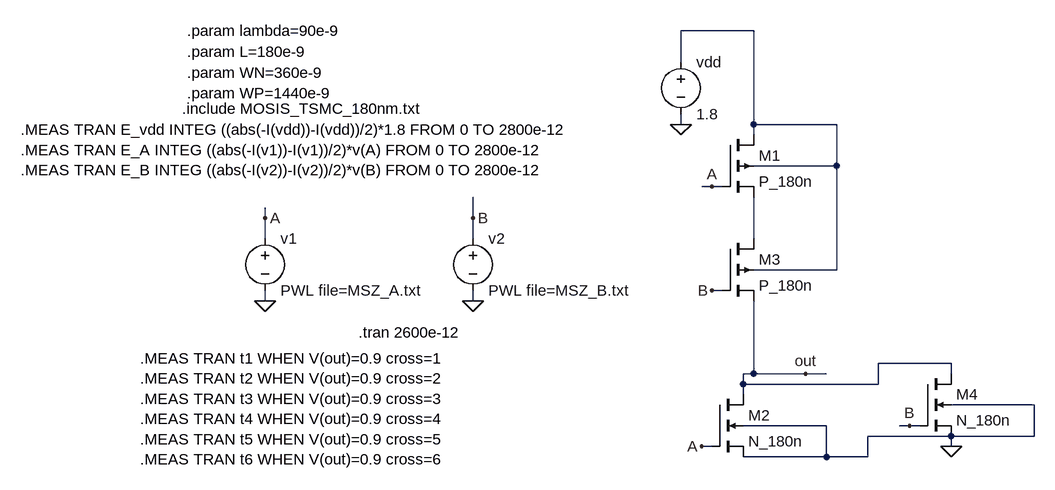
[diagram p0: schematic nor.asc]
nor.asc, the LTspice schematic file:
Version 4
SHEET 1 1028 680
WIRE 576 -128 464 -128
WIRE 464 -80 464 -128
WIRE 464 16 464 0
WIRE 576 16 576 -128
WIRE 704 16 576 16
WIRE 576 32 576 16
WIRE 704 80 704 16
WIRE 704 80 576 80
WIRE 512 112 496 112
WIRE 528 112 512 112
WIRE -176 160 -176 144
WIRE 144 160 144 128
WIRE -176 192 -176 160
WIRE 144 192 144 160
WIRE 576 192 576 128
WIRE 704 240 704 80
WIRE 704 240 576 240
WIRE 528 272 512 272
WIRE -176 288 -176 272
WIRE 144 288 144 272
WIRE 880 384 768 384
WIRE 576 400 576 288
WIRE 576 400 560 400
WIRE 656 400 576 400
WIRE 688 400 656 400
WIRE 880 400 880 384
WIRE 560 416 560 400
WIRE 768 416 768 384
WIRE 768 416 560 416
WIRE 560 432 560 416
WIRE 1008 448 880 448
WIRE 688 480 560 480
WIRE 816 480 800 480
WIRE 832 480 816 480
WIRE 880 496 752 496
WIRE 1008 496 1008 448
WIRE 1008 496 880 496
WIRE 512 512 496 512
WIRE 880 512 880 496
WIRE 688 528 688 480
WIRE 688 528 560 528
WIRE 752 528 752 496
WIRE 752 528 688 528
FLAG 880 512 0
FLAG 464 16 0
FLAG -176 288 0
FLAG 144 288 0
FLAG -176 160 A
FLAG 512 112 A
FLAG 496 512 A
FLAG 144 160 B
FLAG 512 272 B
FLAG 816 480 B
FLAG 656 400 out
SYMBOL pmos4 528 32 R0
SYMATTR InstName M1
SYMATTR Value P_180n
SYMATTR Value2 l={L} w={WP} ad={WP*5*lambda} as={WP*5*lambda} pd={2*WP+10*lambda} ps={2*WP+10*lambda}
SYMBOL nmos4 512 432 R0
SYMATTR InstName M2
SYMATTR Value N_180n
SYMATTR Value2 l={L} w={WN} ad={WN*5*lambda} as={WN*5*lambda} pd={2*WN+10*lambda} ps={2*WN+10*lambda}
SYMBOL voltage 464 -96 R0
SYMATTR InstName vdd
SYMATTR Value 1.8
SYMBOL pmos4 528 192 R0
SYMATTR InstName M3
SYMATTR Value P_180n
SYMATTR Value2 l={L} w={WP} ad={WP*5*lambda} as={WP*5*lambda} pd={2*WP+10*lambda} ps={2*WP+10*lambda}
SYMBOL nmos4 832 400 R0
SYMATTR InstName M4
SYMATTR Value N_180n
SYMATTR Value2 l={L} w={WN} ad={WN*5*lambda} as={WN*5*lambda} pd={2*WN+10*lambda} ps={2*WN+10*lambda}
SYMBOL voltage -176 176 R0
WINDOW 123 0 0 Left 0
WINDOW 39 0 0 Left 0
SYMATTR InstName v1
SYMATTR Value PWL file=MSZ_A.txt
SYMBOL voltage 144 176 R0
WINDOW 123 0 0 Left 0
WINDOW 39 0 0 Left 0
SYMATTR InstName v2
SYMATTR Value PWL file=MSZ_B.txt
TEXT -296 -128 Left 2 !.param lambda=90e-9
TEXT -296 -96 Left 2 !.param L=180e-9
TEXT -296 -64 Left 2 !.param WN=360e-9
TEXT -296 -32 Left 2 !.param WP=1440e-9
TEXT -32 336 Left 2 !.tran 2600e-12
TEXT -304 -8 Left 2 !.include MOSIS_TSMC_180nm.txt
TEXT -368 376 Left 2 !.MEAS TRAN t1 WHEN V(out)=0.9 cross=1\n.MEAS TRAN t2 WHEN V(out)=0.9 cross=2\n.MEAS TRAN t3 WHEN V(out)=0.9 cross=3\n.MEAS TRAN t4 WHEN V(out)=0.9 cross=4\n.MEAS TRAN t5 WHEN V(out)=0.9 cross=5\n.MEAS TRAN t6 WHEN V(out)=0.9 cross=6
TEXT -552 24 Left 2 !.MEAS TRAN E_vdd INTEG ((abs(-I(vdd))-I(vdd))/2)*1.8 FROM 0 TO 2800e-12\n.MEAS TRAN E_A INTEG ((abs(-I(v1))-I(v1))/2)*v(A) FROM 0 TO 2800e-12\n.MEAS TRAN E_B INTEG ((abs(-I(v2))-I(v2))/2)*v(B) FROM 0 TO 2800e-12

The netlist it stands for:
* nor.asc
M1 N001 A N002 N001 P_180n l={L} w={WP} ad={WP*5*lambda} as={WP*5*lambda} pd={2*WP+10*lambda} ps={2*WP+10*lambda}
M2 out A 0 0 N_180n l={L} w={WN} ad={WN*5*lambda} as={WN*5*lambda} pd={2*WN+10*lambda} ps={2*WN+10*lambda}
vdd N001 0 1.8
M3 N002 B out N001 P_180n l={L} w={WP} ad={WP*5*lambda} as={WP*5*lambda} pd={2*WP+10*lambda} ps={2*WP+10*lambda}
M4 out B 0 0 N_180n l={L} w={WN} ad={WN*5*lambda} as={WN*5*lambda} pd={2*WN+10*lambda} ps={2*WN+10*lambda}
v1 A 0 PWL file=MSZ_A.txt
v2 B 0 PWL file=MSZ_B.txt
.model NMOS NMOS
.model PMOS PMOS
.lib standard.mos
.param lambda=90e-9
.param L=180e-9
.param WN=360e-9
.param WP=1440e-9
.tran 2600e-12
.include MOSIS_TSMC_180nm.txt
.MEAS TRAN t1 WHEN V(out)=0.9 cross=1
.MEAS TRAN t2 WHEN V(out)=0.9 cross=2
.MEAS TRAN t3 WHEN V(out)=0.9 cross=3
.MEAS TRAN t4 WHEN V(out)=0.9 cross=4
.MEAS TRAN t5 WHEN V(out)=0.9 cross=5
.MEAS TRAN t6 WHEN V(out)=0.9 cross=6
.MEAS TRAN E_vdd INTEG ((abs(-I(vdd))-I(vdd))/2)*1.8 FROM 0 TO 2800e-12
.MEAS TRAN E_A INTEG ((abs(-I(v1))-I(v1))/2)*v(A) FROM 0 TO 2800e-12
.MEAS TRAN E_B INTEG ((abs(-I(v2))-I(v2))/2)*v(B) FROM 0 TO 2800e-12
.backanno
.end

* Results of the author's LTspice run, read from the files saved beside the schematic
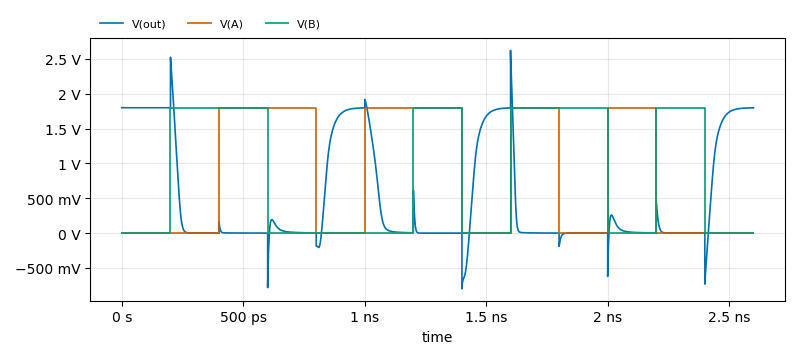
[diagram p1: Transient Analysis of nor.asc, plotted from the saved traces]
* Transient Analysis, 1 run:
*   V(out): min -799.3 mV, max 2.623 V, average 518.4 mV, rms 935.6 mV, last 1.799 V
*   V(A): min 0 V, max 1.8 V, average 830.8 mV, rms 1.223 V, last 0 V
*   V(B): min 0 V, max 1.8 V, average 830.8 mV, rms 1.223 V, last 0 V